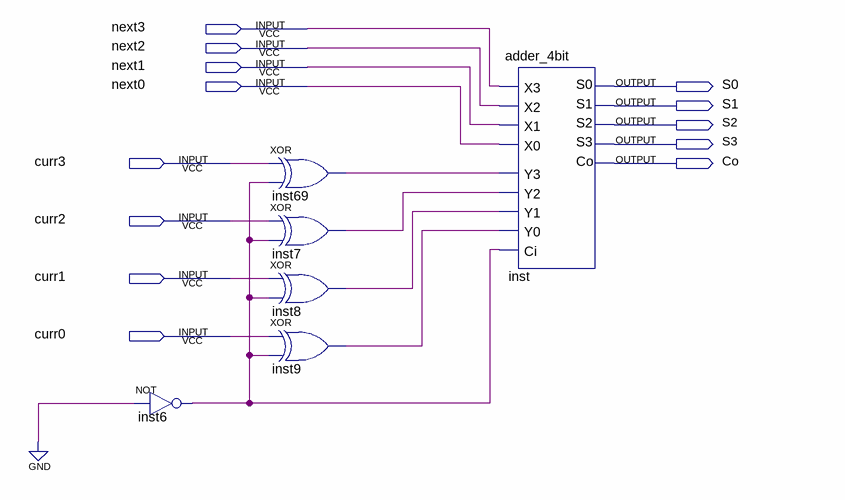
[diagram p0: schematic sheet]
// Quartus schematic comparator.bdf as structural Verilog: 6 symbols, 13 pins
module comparator (
  input  next3,
  input  next2,
  input  next1,
  input  next0,
  input  curr3,
  input  curr2,
  input  curr1,
  input  curr0,
  output S0,
  output S1,
  output S2,
  output S3,
  output Co
);

  wire inst6_out, inst7_out, inst8_out, inst9_out, inst69_out;

  not inst6 (inst6_out, 1'b0);
  xor inst69 (inst69_out, curr3, inst6_out);
  xor inst7 (inst7_out, curr2, inst6_out);
  xor inst8 (inst8_out, curr1, inst6_out);
  xor inst9 (inst9_out, curr0, inst6_out);
  adder_4bit inst (
    .X3(next3), .Y3(inst69_out), .X2(next2), .Y2(inst7_out), .X1(next1), .Y1(inst8_out), .X0(next0),
    .Y0(inst9_out), .Ci(inst6_out), .S0(S0), .S1(S1), .S2(S2), .S3(S3), .Co(Co));
endmodule
